# Altium schematic sheet ADF4356.SchDoc
size A; SheetNumber: 1; SheetTotal: 2
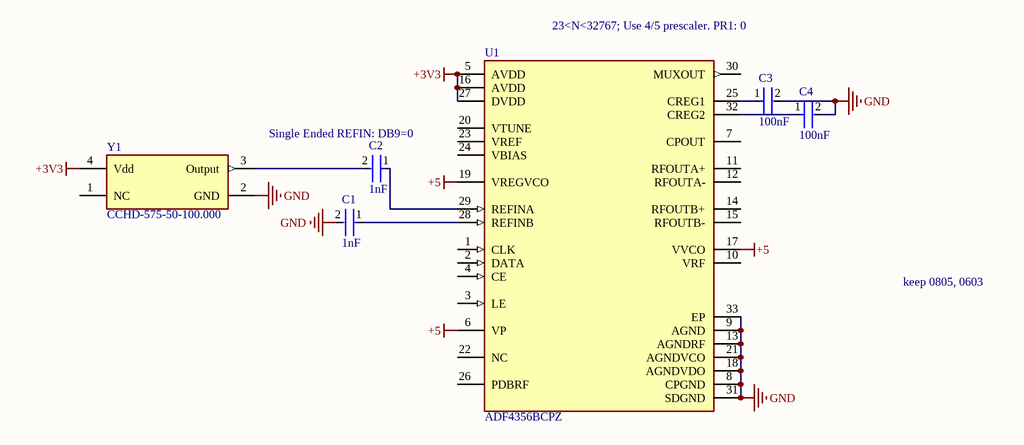
[diagram p0: ADF4356.SchDoc]

## Parts
C1  1nF  [FP-C0603C-CF-MFG]
C2  1nF  [FP-C0603C-CF-MFG]
C3  100nF  [FP-CL21-IPC_C]
C4  100nF  [FP-CL21-IPC_C]
U1  ADF4356BCPZ  [FP-CP-32-12-IPC_B]
Y1  CCHD-575-50-100.000  [FP-CCHD-575-50-100_000-MFG]

## Nets
+3V3: U1.5(AVDD) U1.16(AVDD) U1.27(DVDD) Y1.4(Vdd)
+5: U1.6(VP) U1.17(VVCO) U1.19(VREGVCO)
GND: C1.2 C3.2 C4.2 U1.8(CPGND) U1.9(AGND) U1.13(AGNDRF) U1.18(AGNDVDO) U1.21(AGNDVCO) U1.31(SDGND) U1.33(EP) Y1.2(GND)
NetC1_1: C1.1 U1.28(REFINB)
NetC2_1: C2.1 U1.29(REFINA)
NetC2_2: C2.2 Y1.3(Output)
NetC3_1: C3.1 U1.25(CREG1)
NetC4_1: C4.1 U1.32(CREG2)

Not connected (* = marked no-connect by the designer): U1 1(CLK) 2(DATA) 3(LE) 4(CE) 7(CPOUT) 10(VRF) 11(RFOUTA+) 12(RFOUTA-) 14(RFOUTB+) 15(RFOUTB-) 20(VTUNE) 22(NC) 23(VREF) 24(VBIAS) 26(PDBRF) 30(MUXOUT); Y1 1(NC)

## Notes on the sheet
- (near U1) 23<N<32767; Use 4/5 prescaler. PR1: 0
- (near C2) Single Ended REFIN: DB9=0
- keep 0805, 0603

## Library data of the parts
C1 C2 = CMP-03020-005729-2: C0603 1,000 pF X7R 30ppm/°C 20.00% 50 V; Manufacturer Part Number: C0603C102M5RAC7411; Manufacturer: KEMET; Voltage Rating: 50 V; Material: Ceramic; Tolerance: 0.2; Automotive Grade: Grade 1; Device Class L3: Ceramic Capacitors; Temperature Range Low: -55°C; Package: C0603C-CF; Automotive: Yes; RoHS: TRUE; Temperature Range High: +125°C; Height: 0.87mm; ComponentLink2URL: https://api.kemet.com/component-edge/download/datasheet/C0603C100J5GACAUTO.pdf; Octopart: https://octopart.com/c0603c102m5rac7411-kemet-3864814; Device Class L1: Passive Components; Value: 1,000 pF; Temperature: -55°C to +125°C; Temperature Characteristic: X7R; Temperature Coefficient: 30ppm/°C; Device Class L2: Capacitors; ComponentLink2Description: Datasheet; Category: Cap; Lead Free: Yes; Capacitance: 1,000 pF
C3 C4 = CMP-13271-003456-1: CL21 Series 0805 100nF 50V ±10% Tolerance X7R Multilayer Ceramic Chip Capacitor; Length: 0.079inch; Packaging: Tape and Reel; Tolerance: 10%; Case/Package: 0805; Width: 0.049inch; Voltage Rating: 50V; Min Operating Temperature: -55°C; Features: Soft Termination; Capacitance: 100nF; Ratings: AEC-Q200; Max Operating Temperature: 125°C; Case Code (Metric): 2012; Thickness: 0.053inch; Case Code (Imperial): 0805; Mount: Surface Mount
U1 = CMP-09077-000037-1: IC SYNTH PLL VCO 6.8GHZ 32LFCSP; Input: Clock; Number of Circuits: 1; PLL: Yes; Number of Pins: 32; Max Frequency: 6.8GHz; Mount: Surface Mount; RoHS Compliant: Yes; Min Operating Temperature: -40°C; Packaging: Tray; Max Operating Temperature: 85°C
Y1 = CMP-82233-000007-1: XTAL OSC XO 100.0000MHZ HCMOS; Frequency: 100MHz; Max Supply Current: 25mA; Load Capacitance: 15pF; Frequency Stability: 50ppm; Operating Supply Voltage: 3.3V; Mount: Surface Mount; Max Operating Temperature: 70°C; Case/Package: SMD/SMT; Length: 0.295inch; Width: 0.2inch; Packaging: Strip; Package Quantity: 25; Min Operating Temperature: 0°C; Height: 0.098inch; Series: CCHD-575; Termination: SMD/SMT